# Altium schematic sheet CW340_SPI_flashes.SchDoc: SPI Flash & Breakout
size Letter; Organization: NewAE Technology Inc.; Address1: 1083 Queen St., Suite 196; Address2: Halifax; Address3: NS; Address4: Canada B3H 0B2; DocumentNumber: .; Revision: .; SheetNumber: 24; SheetTotal: 31; SheetApproved: NO
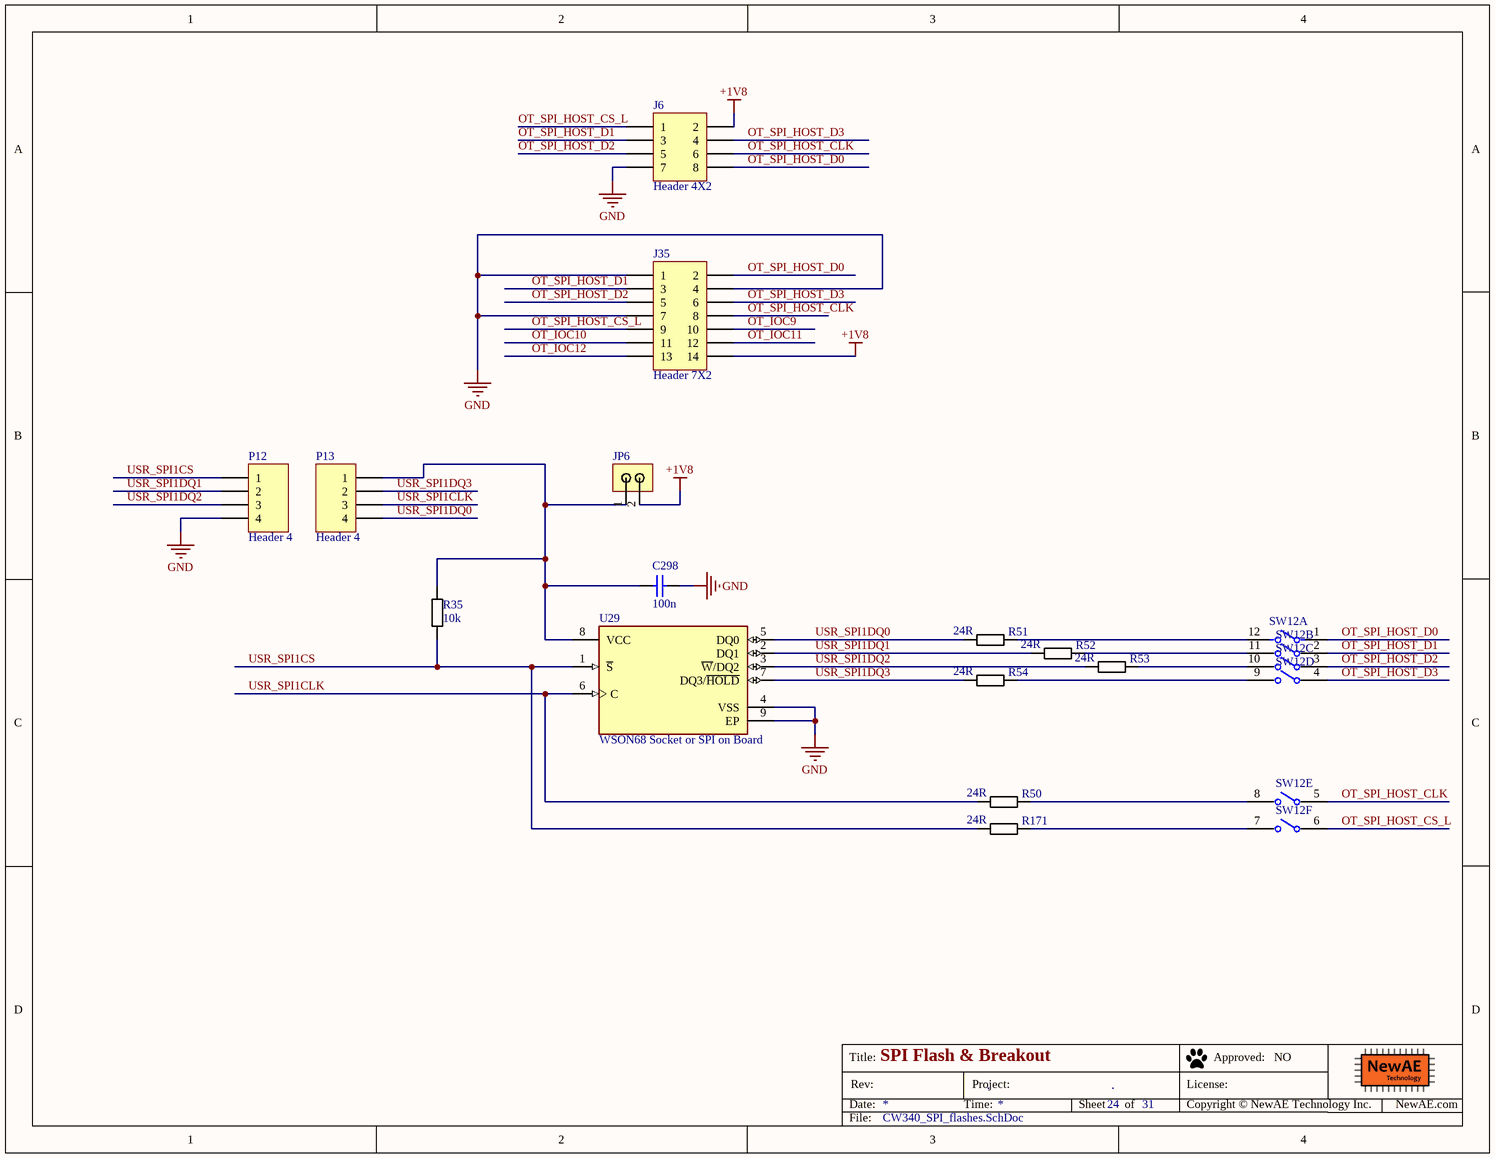
[diagram p0: CW340_SPI_flashes.SchDoc]

## Parts
C298  100n  [CAPC0402_M]
J6  Header 4X2  [HDR2X4]
J35  Header 7X2  [HDR2X7]
JP6  Jumper  [2x2.54mm_Header]  (value not drawn)
P12  Header 4  [HDR1X4]
P13  Header 4  [HDR1X4]
R35  10k  [RESC1005X40N]
R50  24R  [RESC1005X40N]
R51  24R  [RESC1005X40N]
R52  24R  [RESC1005X40N]
R53  24R  [RESC1005X40N]
R54  24R  [RESC1005X40N]
R171  24R  [RESC1005X40N]
SW12  A6H-6101-PM  [FP-A6H-6101-PM-MFG]  (value not drawn)  (parts A,B,C,D,E,F of 6)
U29  WSON68 Socket or SPI on Board  [SOK-SPI-WSON68_ORCHIP]

## Nets
+1V8: J6.2 J35.14 JP6.2
GND: C298.2 J6.7 J35.1 J35.4 J35.7 P12.4 U29.4(VSS) U29.9(EP)
OT_IOC9: J35.10
OT_IOC10: J35.11
OT_IOC11: J35.12
OT_IOC12: J35.13
OT_SPI_HOST_CLK: J6.6 J35.8 SW12.5
OT_SPI_HOST_CS_L: J6.1 J35.9 SW12.6
OT_SPI_HOST_D0: J6.8 J35.2 SW12.1
OT_SPI_HOST_D1: J6.3 J35.3 SW12.2
OT_SPI_HOST_D2: J6.5 J35.5 SW12.3
OT_SPI_HOST_D3: J6.4 J35.6 SW12.4
USR_SPI1CLK: P13.3 R50.1 U29.6(C)
USR_SPI1CS: P12.1 R35.2 R171.1 U29.1(~{S})
USR_SPI1DQ0: P13.4 R51.1 U29.5(DQ0)
USR_SPI1DQ1: P12.2 R52.1 U29.2(DQ1)
USR_SPI1DQ2: P12.3 R53.1 U29.3(~{W}/DQ2)
USR_SPI1DQ3: P13.2 R54.1 U29.7(DQ3/~{HOLD})
NetC298_1: C298.1 JP6.1 P13.1 R35.1 U29.8(VCC)
NetR50_2: R50.2 SW12.8
NetR51_2: R51.2 SW12.12
NetR52_2: R52.2 SW12.11
NetR53_2: R53.2 SW12.10
NetR54_2: R54.2 SW12.9
NetR171_2: R171.2 SW12.7

## Notes on the sheet
- Title:
- Date:
- Rev:
- Time:
- Project:
- Sheet
- of
- License:
- Copyright © NewAE Technology Inc.
- Approved:
- NewAE.com
- File:

## Library data of the parts
C298 = CCHIP-100n-0402: 100n, 0402; Manufacture Part Number 1: CGA2B3X7R1V104K050BB; Component Group: Capacitor; Case-EIA: 0402; Part Number: CCHIP-100n-0402; Footprint: 0402; Pin Count: 2; Value: 100n; Mounting Technology: SMT; Component Kind: Standard; Component Type: Standard; Supplier 1: Digi-Key; Supplier Part Number 1: 445-6901-1-ND
J6 = Header 4X2: Header, 4-Pin, Dual row; LatestRevisionDate: 17-Jul-2002; LatestRevisionNote: Re-released for DXP Platform.; Publisher: Altium Limited
J35 = Header 7X2: Header, 7-Pin, Dual row; LatestRevisionDate: 17-Jul-2002; LatestRevisionNote: Re-released for DXP Platform.; Publisher: Altium Limited
JP6 = 2_PIN_JUMPER: 1x2 2.54mm header, male pins; Manufacture 1: Harwin; Manufacture Part Number 1: M20-9990246; Component Group: PCB Feature; PP Material Stack: 0; Part Number: 2_PIN_JUMPER; Pin Count: 2; Supplier 1: Digi-Key; Supplier Part Number 1: 952-2262-ND; Mounting Technology: Through-hole; RoHS: Yes; Component Kind: Standard; Component Type: Standard; PP Rotation: 0
P12 P13 = Header 4: Header, 4-Pin; LatestRevisionDate: 17-Jul-2002; LatestRevisionNote: Re-released for DXP Platform.; Publisher: Altium Limited
R35 = RCHIP-10K-0402: 10k res, 0402, 1%, 1/16W; Manufacture 1: Yageo; Manufacture Part Number 1: RC0402FR-0710KL; Component Group: Resistor; Case-EIA: 0402; Case-Metric: 1005; Rated Power: 0.063W; Rated Voltage: 75VDC; Part Number: RCHIP-10K-0402; Footprint: 0402; Pin Count: 2; Supplier 1: Digi-Key; Supplier Part Number 1: 311-10.0KLRCT-ND; Value: 10k; Tolerance: 1%; Mounting Technology: SMT; Temperature Range: -55C to 155C; Component Kind: Standard; Component Type: Standard
R50-R54 R171 = RCHIP-24R-0402: 24R res, 0402, 1%, 1/16W; Manufacture 1: Yageo; Manufacture Part Number 1: RC0402FR-0724RL; Component Group: Resistor; Case-EIA: 0402; Case-Metric: 1005; Rated Power: 0.063W; Rated Voltage: 75VDC; Part Number: RCHIP-24R-0402; Footprint: 0402; Pin Count: 2; Supplier 1: Digi-Key; Supplier Part Number 1: YAG3073CT-ND; Value: 24R; Tolerance: 1%; Mounting Technology: SMT; Temperature Range: -55C to 155C; Component Kind: Standard; Component Type: Standard
SW12 = A6H-6101-PM: 6 DIP switch SMD; Manufacture 1: Omron; PP Material Stack: 0; Part Number: A6H-6101-PM; Component Group: Switch; Footprint: SSOP-12; Manufacture Part Number 1: A6H-6101-PM; Pin Count: 12; Component Kind: Standard; Component Type: Standard; PP Rotation: 0; PP Rotation1: 0
U29 = SOK-SPI-WSON68_OR_QSPI: WSON-6x8 Socket OR WSON Flash; Manufacture 1: Dedi-Prog/Micron; Manufacture Part Number 1: SOK-SPI-WSON68 / MT25QL256ABA1EW9-0SIT; Component Group: Connector; PP Material Stack: 0; Part Number: SOK-SPI-WSON68_OR_QSPI; Footprint: WSON-8x6; Pin Count: 8; Supplier 1: Digi-Key; Mounting Technology: SMT; RoHS: Yes; Component Kind: Standard; Component Type: Standard; PP Rotation: 0; PP Rotation1: 0